# Altium schematic sheet 示波器原理图3.SchDoc
size A4
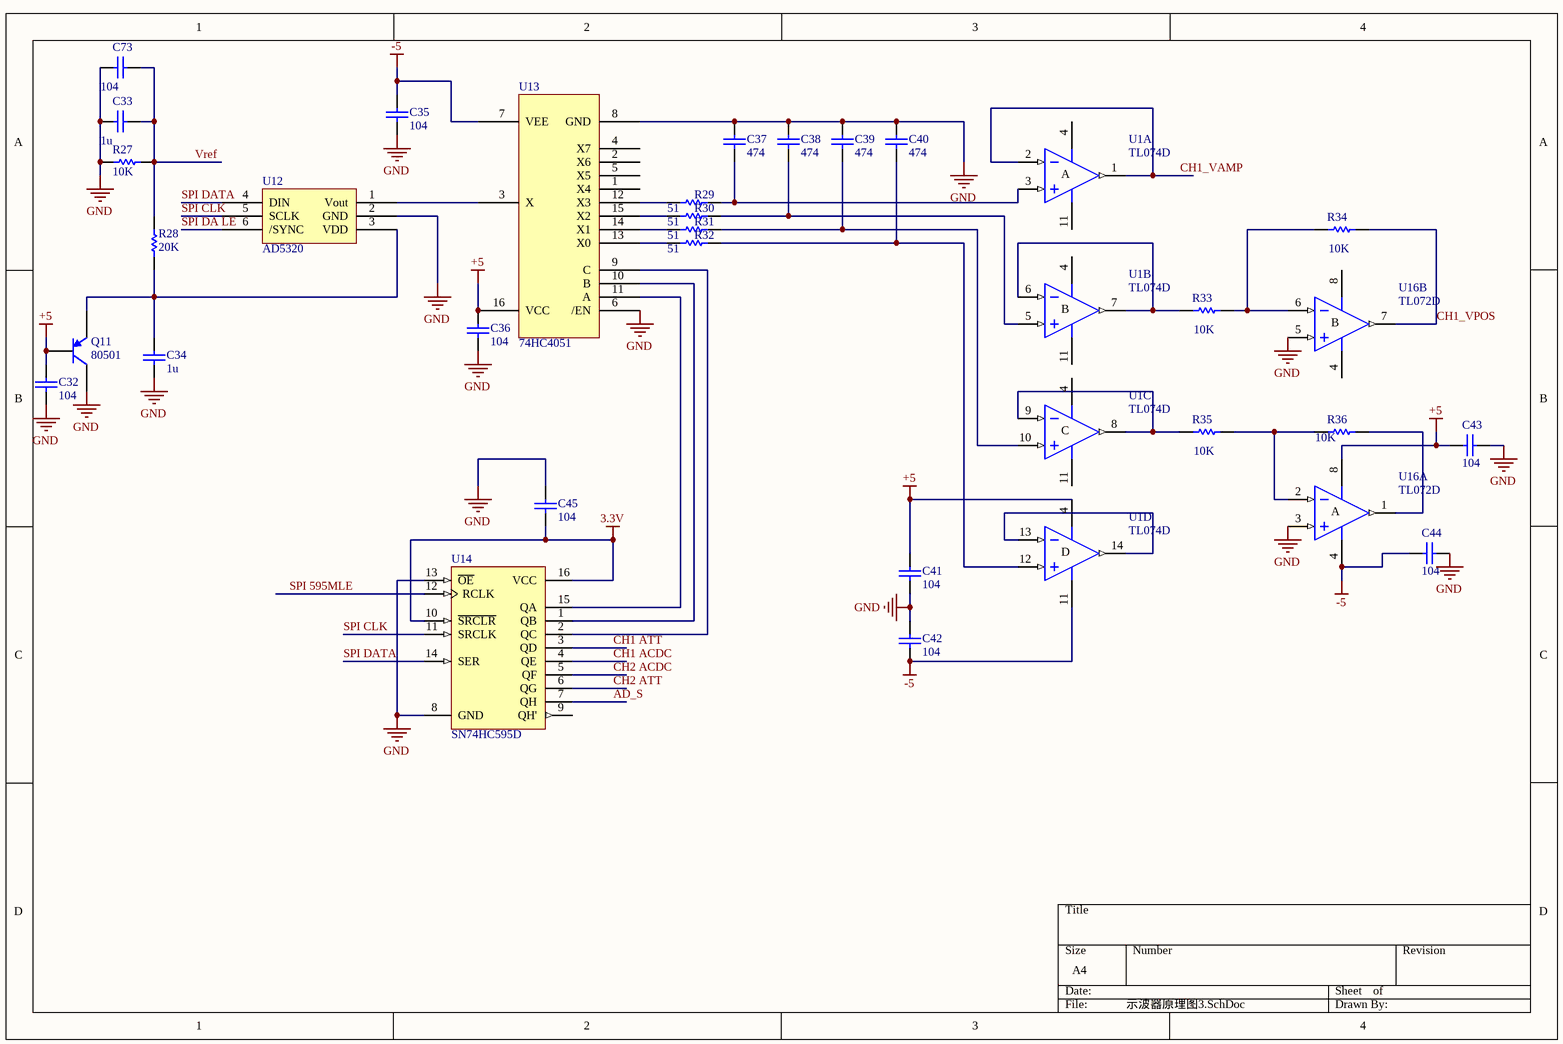
[diagram p0: 示波器原理图3.SchDoc]

## Parts
C32  value 104  [PCBComponent_1]
C33  value 1u  [PCBComponent_1]
C34  value 1u  [PCBComponent_1]
C35  value 104  [PCBComponent_1]
C36  value 104  [PCBComponent_1]
C37  value 474  [PCBComponent_1]
C38  value 474  [PCBComponent_1]
C39  value 474  [PCBComponent_1]
C40  value 474  [PCBComponent_1]
C41  value 104  [PCBComponent_1]
C42  value 104  [PCBComponent_1]
C43  value 104  [PCBComponent_1]
C44  value 104  [PCBComponent_1]
C45  value 104  [PCBComponent_1]
C73  value 104  [PCBComponent_1]
Q11  80501  [PCBComponent_1]
R27  value 10K  [PCBComponent_1]
R28  value 20K  [PCBComponent_1]
R29  51  [2012[0805]]
R30  51  [2012[0805]]
R31  51  [2012[0805]]
R32  51  [2012[0805]]
R33  value 10K  [2012[0805]]
R34  value 10K  [2012[0805]]
R35  value 10K  [2012[0805]]
R36  value 10K  [2012[0805]]
U1  TL074D  [SOP127P600X175-14N]  (parts A,B,C,D of 4)
U12  AD5320  [SOT86P280X110-6N]
U13  74HC4051  [SOP127P600X175-16N]
U14  SN74HC595D  [SOP127P600X175-16N]
U16  TL072D  [SOP127P600X175-8N]  (parts A,B of 2)

## Nets
3.3V: C45.1 U14.10(~{SRCLR}) U14.16(VCC)
+5: C32.2 C36.2 C41.1 C43.1 Q11.2(B) U1.4(V+) U13.16(VCC) U16.8(V+)
-5: C35.2 C42.2 C44.1 U1.11(V-) U13.7(VEE) U16.4(V-)
GND: C32.1 C33.1 C34.1 C35.1 C36.1 C37.2 C38.2 C39.2 C40.2 C41.2 C42.1 C43.2 C44.2 C45.2 C73.1 Q11.3(C) R27.2 U12.2(GND) U13.6(/EN) U13.8(GND) U14.8(GND) U14.13(~{OE}) U16.3(IN+) U16.5(IN+)
AD_S: U14.7(QH)
CH1 ACDC: U14.4(QE)
CH1 ATT: U14.3(QD)
CH1_VAMP: U1.1(OUT) U1.2(IN-)
CH1_VPOS: R34.2 U16.7(OUT)
CH2 ACDC: U14.5(QF)
CH2 ATT: U14.6(QG)
SPI 595MLE: U14.12(RCLK)
SPI CLK: U12.5(SCLK) U14.11(SRCLK)
SPI DA LE: U12.6(/SYNC)
SPI DATA: U12.4(DIN) U14.14(SER)
Vref: C33.2 C73.2 R27.1 R28.1
NetC34_2: C34.2 Q11.1(E) R28.2 U12.3(VDD)
NetC37_1: C37.1 R29.2 U1.3(IN+)
NetC38_1: C38.1 R30.2 U1.5(IN+)
NetC39_1: C39.1 R31.2 U1.10(IN+)
NetC40_1: C40.1 R32.2 U1.12(IN+)
NetR29_1: R29.1 U13.12(X3)
NetR30_1: R30.1 U13.15(X2)
NetR31_1: R31.1 U13.14(X1)
NetR32_1: R32.1 U13.13(X0)
NetR33_1: R33.1 U1.6(IN-) U1.7(OUT)
NetR33_2: R33.2 R34.1 U16.6(IN-)
NetR35_1: R35.1 U1.8(OUT) U1.9(IN-)
NetR35_2: R35.2 R36.1 U16.2(IN-)
NetR36_2: R36.2 U16.1(OUT)
NetU1_13: U1.13(IN-) U1.14(OUT)
NetU12_1: U12.1(Vout) U13.3(X)
NetU13_9: U13.9(C) U14.2(QC)
NetU13_10: U13.10(B) U14.1(QB)
NetU13_11: U13.11(A) U14.15(QA)

Not connected (* = marked no-connect by the designer): U13 1(X4) 2(X6) 4(X7) 5(X5); U14 9(QH')

## Notes on the sheet
- (in symbol TL072D, part A) A
- (in symbol TL072D, part B) B
- (in symbol TL074D, part A) A
- (in symbol TL074D, part B) B
- (in symbol TL074D, part C) C
- (in symbol TL074D, part D) D

## Library data of the parts
C32-C45 C73 = Cap: Capacitor; Published: 8-Jun-2000; LatestRevisionDate: 17-Jul-2002; LatestRevisionNote: Re-released for DXP Platform.; PackageReference: RAD-0.3; Publisher: Altium Limited
Q11 = 2N3906: PNP General Purpose Amplifier; Published: 8-Jun-2000; LatestRevisionDate: 15-Jan-2003; LatestRevisionNote: PCB Footprint 'BCY-W3/D4.7' replaced; DatasheetDocument: 1997; PackageDocument: Sep-1998; PackageReference: TO-92A; Publisher: Altium Limited; Code_JEDEC: TO-92A; ComponentLink1Description: Manufacturer Link; ComponentLink1URL: http://www.fairchildsemi.com/; ComponentLink2Description: Datasheet; ComponentLink2URL: http://www.fairchildsemi.com/ds/2N%2F2N3906.pdf
R27 R28 = Res1: Resistor; Published: 8-Jun-2000; LatestRevisionDate: 17-Jul-2002; LatestRevisionNote: Re-released for DXP Platform.; PackageReference: AXIAL-0.3; Publisher: Altium Limited
R29-R36 = Res Semi: Semiconductor Resistor; Published: 8-Jun-2000; LatestRevisionDate: 17-Jul-2002; LatestRevisionNote: Re-released for DXP Platform.; PackageReference: AXIAL-0.5; Publisher: Altium Limited
U1 = TL074D: Low-Noise JFET-Input Operational Amplifier; Published: 16-Jan-2001; LatestRevisionDate: 13-Apr-2006; LatestRevisionNote: IPC-7351 Footprint Added.; DatasheetVersion: Aug-1996; PackageVersion: Jan-1998; PackageReference: D014; Publisher: Altium Limited; PackageDescription: 14-Pin Small Outline Integrated Circuit 1.27 mm Pitch; Code_IPC: SOIC127P600-14; ComponentLink1Description: Manufacturer Link; ComponentLink1URL: http://www.ti.com/; ComponentLink2Description: Datasheet; ComponentLink2URL: http://www-s.ti.com/sc/ds/tl074.pdf
U12 U13 = Component_1
U14 = SN74HC595D: 8-Bit Shift Register with 3-State Output Registers; Published: 8-Jun-2000; LatestRevisionDate: 13-Apr-2006; LatestRevisionNote: IPC-7351 Footprint Added.; DatasheetVersion: May-1997; PackageVersion: Jan-1998; PackageReference: D016; Publisher: Altium Limited; PackageDescription: 16-Pin Small Outline Integrated Circuit 1.27 mm Pitch; Code_IPC: SOIC127P600-16; ComponentLink1Description: Manufacturer Link; ComponentLink1URL: http://www.ti.com/; ComponentLink2Description: Datasheet; ComponentLink2URL: http://www-s.ti.com/sc/ds/sn74hc595.pdf
U16 = TL072D: Low-Noise JFET-Input Operational Amplifier; Published: 16-Jan-2001; LatestRevisionDate: 13-Apr-2006; LatestRevisionNote: IPC-7351 Footprint Added.; DatasheetVersion: Aug-1996; PackageVersion: Jan-1998; PackageReference: D008; Publisher: Altium Limited; PackageDescription: 8-Pin Small Outline Integrated Circuit 1.27 mm Pitch; Code_IPC: SOIC127P600-8; ComponentLink1Description: Manufacturer Link; ComponentLink1URL: http://www.ti.com/; ComponentLink2Description: Datasheet; ComponentLink2URL: http://www-s.ti.com/sc/ds/tl072.pdf